# Altium schematic sheet PWR_5V_3A.SchDoc
size A4; Author: Audran; CompanyName: Goldorak; Address1: Electrolab; Address2: 52 rue Paul Lescop; Address3: 92000 Nanterre; DocumentNumber: 2; SheetNumber: 2; SheetTotal: 3; ProjectName: Cartes_2017
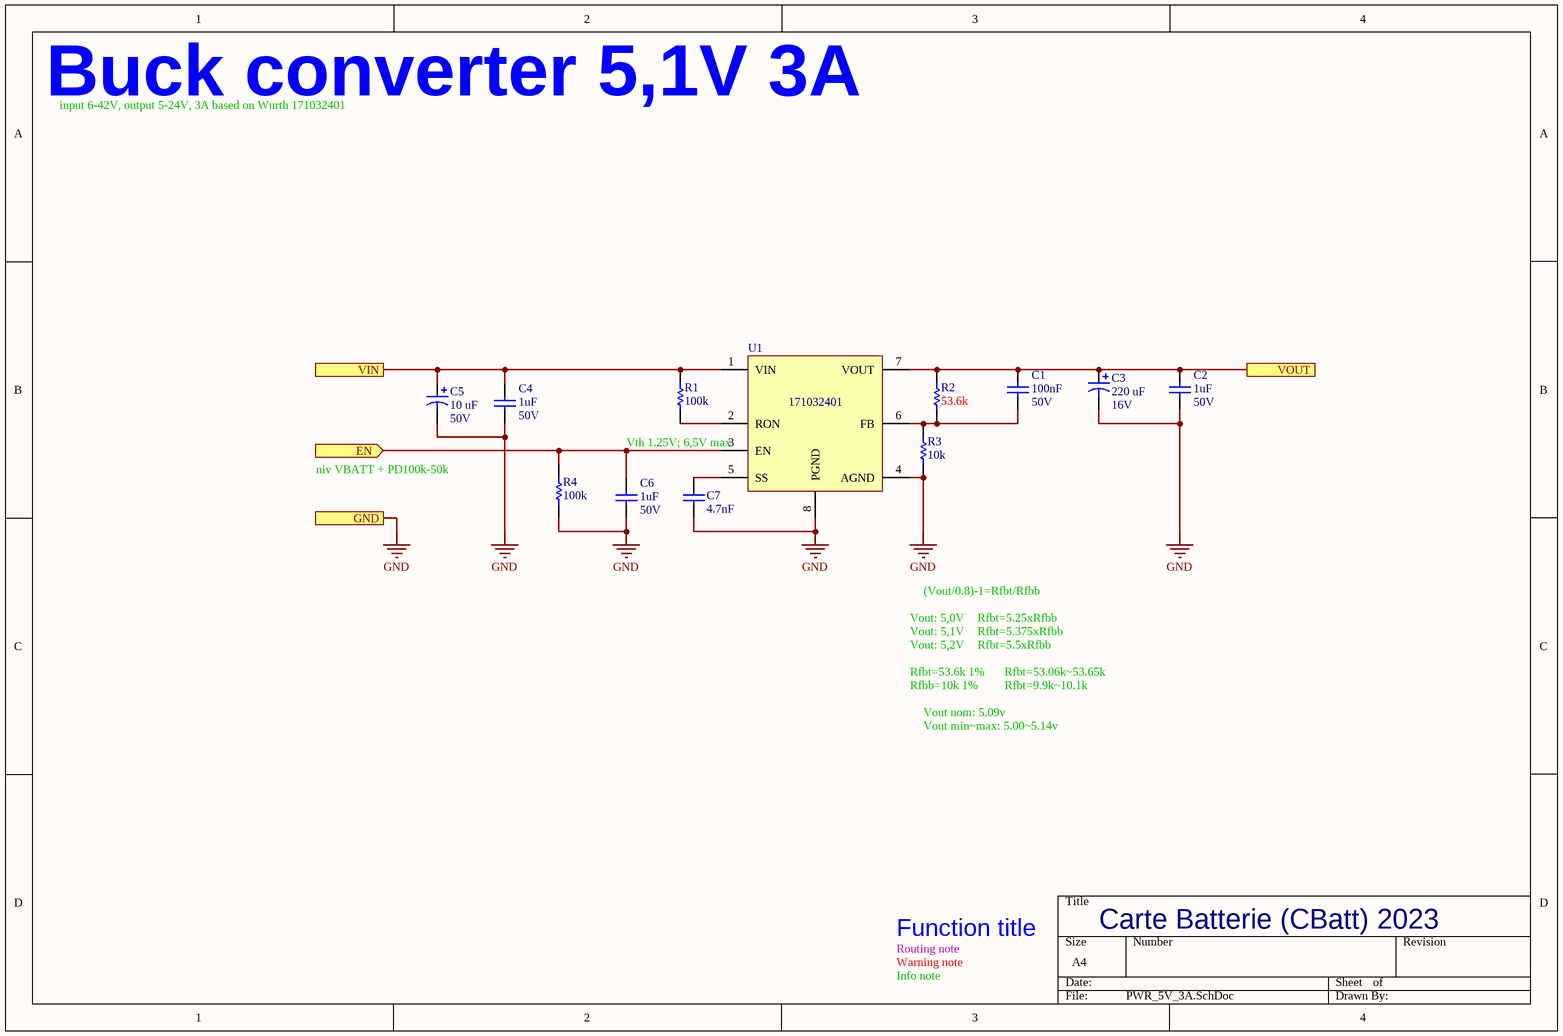
[diagram p0: PWR_5V_3A.SchDoc]

## Parts
C1  100nF  RatedVoltage: 50V  [WCAP-CSGP_0603, 1.6x0.8x0.8]
C2  1uF  RatedVoltage: 50V  [WCAP-CSGP_0805, 2x1.25x1.25]
C3  220 uF  RatedVoltage: 16V  [WCAP-ATG8_6.3x11x2.5x0.5]
C4  1uF  RatedVoltage: 50V  [WCAP-CSGP_0805, 2x1.25x1.25]
C5  10 uF  RatedVoltage: 50V  [WCAP-ATG8_5x11x2x0.5]
C6  1uF  RatedVoltage: 50V  [WCAP-CSGP_0805, 2x1.25x1.25]
C7  4.7nF  [WCAP-CSGP_0603, 1.6x0.8x0.8]
R1  value 100k  [RESC1608X06N]  (hidden comment: RC0603FR-07100KL)
R2  value 53.6k  [RESC1608X06N]  (hidden comment: RC0603FR-0710KL)
R3  value 10k  [RESC1608X06N]  (hidden comment: RC0603FR-0710KL)
R4  value 100k  [RESC1608X06N]  (hidden comment: RC0603FR-07100KL)
U1  171032401  [WPME-VDRM_TO263-7EP]

## Ports
EN (in), GND, VIN, VOUT

## Nets
GND: C2.1 C3.2 C4.1 C5.2 C6.1 C7.1 R3.1 R4.1 U1.4(AGND) U1.8(PGND) ; port GND
EN: C6.2 R4.2 U1.3(EN) ; port EN
VIN: C4.2 C5.1 R1.2 U1.1(VIN) ; port VIN
VOUT: C1.2 C2.2 C3.1 R2.2 U1.7(VOUT) ; port VOUT
NetC1_1: C1.1 R2.1 R3.2 U1.6(FB)
NetC7_2: C7.2 U1.5(SS)
NetR1_1: R1.1 U1.2(RON)

## Notes on the sheet
- Buck converter 5,1V 3A
- input 6-42V, output 5-24V, 3A based on Wurth 171032401
- (near U1) Vth 1.25V; 6,5V max
- niv VBATT + PD100k-50k
- Vout: 5,1V
- Vout: 5,2V
- Vout: 5,0V
- (Vout/0.8)-1=Rfbt/Rfbb
- Rfbt=5.375xRfbb
- Rfbt=5.5xRfbb
- Rfbt=5.25xRfbb
- Rfbt=53.6k 1%
- Rfbb=10k 1%
- Vout nom: 5.09v
- Rfbt=53.06k~53.65k
- Rfbt=9.9k~10.1k
- Vout min~max: 5.00~5.14v
- Routing note
- Warning note
- Info note
- Function title
- Carte Batterie (CBatt) 2023

## Library data of the parts
C1 = WCAP-CSGP, 885012206095: CAP CER 100nF 50V X7R 0603; Manufacturer: Wurth Elektronik; ComponentLink1Description: Datasheet; ComponentLink1URL: http://katalog.we-online.com/pbs/datasheet/885012206095.pdf; Value: 100nF; Size: 0603; CeramicType: X7R; Manufacturer Part Number: 885012206095; Supplier 2: JLCPCB; Supplier Part Number 2: C14663; Supplier Footprint 2: 0603
C2 C4 C6 = WCAP-CSGP, 885012207103: CAP CER 1uF 50V X7R 0805; Manufacturer: Wurth Elektronik; ComponentLink1Description: Datasheet; ComponentLink1URL: http://katalog.we-online.com/pbs/datasheet/885012207103.pdf; Manufacturer Part Number: 885012207103; Value: 1uF; Size: 0805; CeramicType: X7R; Supplier 2: JLCPCB; Supplier Part Number 2: C28323; Supplier Footprint 2: 0805
C3 = WCAP-ATG8, 860010373010: CAP Alu 220 UF 20% 16 V; Manufacturer: Wurth Elektronik; ComponentLink1Description: Datasheet; ComponentLink1URL: http://katalog.we-online.de/pbs/datasheet/860010373010.pdf; Manufacturer Part Number: 860010373010; Value: 220 uF; Size: 6.3mmx11mm
C5 = WCAP-ATG8, 860010672009: CAP Alu 10 UF 20% 50 V; Manufacturer: Wurth Elektronik; ComponentLink1Description: Datasheet; ComponentLink1URL: http://katalog.we-online.de/pbs/datasheet/860010672009.pdf; Manufacturer Part Number: 860010672009; Value: 10 uF; Size: 5mmx11mm
C7 = WCAP-CSGP, 885012206087: CAP CER 4.7nF 50V X7R 0603; Manufacturer: Wurth Elektronik; ComponentLink1Description: Datasheet; ComponentLink1URL: http://katalog.we-online.com/pbs/datasheet/885012206087.pdf; Manufacturer Part Number: 885012206087; Value: 4.7nF; Size: 0603; CeramicType: X7R; RatedVoltage: 50V; Supplier 2: JLCPCB; Supplier Part Number 2: C53987; Supplier Footprint 2: 0603; Supplier 1: Farnell; Supplier Part Number 1: 2495180
R1 R4 = RC0603FR-07100KL: RES SMD 100K OHM 1% 1/10W 0603; Manufacturer: Yageo; Power: 100mW; Vmax: 50V; Manufacturer Part Number: RC0603FR-07100KL; Type: Thick Film; ComponentLink1Description: Manufacturer; ComponentLink1URL: http://www.yageo.com/NewPortal/_en/index.jsp; ComponentLink2Description: Datasheet; ComponentLink2URL: http://www.farnell.com/datasheets/2167052.pdf; Supplier 1: Farnell; Supplier Part Number 1: 2309107; Precision: ±1%; Supplier 2: JLCPCB; Supplier Part Number 2: C25803; Supplier Footprint 2: 0603
R2 R3 = RC0603FR-0710KL: RES SMD 10K OHM 1% 1/10W 0603; Manufacturer: Yageo; Power: 100mW; Vmax: 50V; Manufacturer Part Number: RC0603FR-0710KL; Type: Thick Film; ComponentLink1Description: Manufacturer; ComponentLink1URL: http://www.yageo.com/NewPortal/_en/index.jsp; ComponentLink2Description: Datasheet; ComponentLink2URL: http://www.farnell.com/datasheets/2167052.pdf; Supplier 1: Farnell; Supplier Part Number 1: 9238603; Precision: ±1%; Supplier 2: JLCPCB; Supplier Footprint 2: 0603
  R3: Supplier Part Number 2: C25804
U1 = 171032401: WPME-VDRM DCDC 6-42Vin, 5-24Vout, 3Aout TO263-7EP; Manufacturer: Wurth Elektronik; Manufacturer Part Number: 171032401; ComponentLink1Description: Website Link; ComponentLink1URL: https://www.we-online.com/redexpert/article/171032401?ad; ComponentLink2Description: Datasheet Link; ComponentLink2URL: https://www.we-online.com/redexpert/spec/171032401?ad; Supplier 1: Farnell; Supplier Part Number 1: 2505849